# Altium schematic sheet BLM15AG100SN1D1_BLM15AG100SN1D.schdoc
size 127 x 99 mm
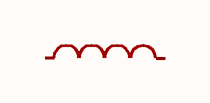
[diagram p0: BLM15AG100SN1D1_BLM15AG100SN1D.schdoc]

## Parts
L?  BLM15AG100SN1D  [L0402]  (value not drawn)

## Nets

Not connected (* = marked no-connect by the designer): L? 1 2

## Library data of the parts
L? = BLM15AG100SN1D: Manufacturer: muRata(村田); Add into BOM: yes; Impedance @ Frequency: 10Ω@100MHz; DC Resistance(DCR): 25mΩ; Current Rating: 1A; Number of Circuits: 1; Symbol: BLM15AG100SN1D; Device: BLM15AG100SN1D; LCSC Part Name: 单路 0402磁珠 阻抗10Ω@100MHz; Supplier Part: C76882; Manufacturer Part: BLM15AG100SN1D; Supplier Footprint: 0402; JLCPCB Part Class: Extended Part; Datasheet: https://item.szlcsc.com/datasheet/BLM15AG100SN1D/78009.html; Supplier: LCSC; Convert to PCB: yes; Tolerance: -; Operating Temperature: -55℃~+125℃